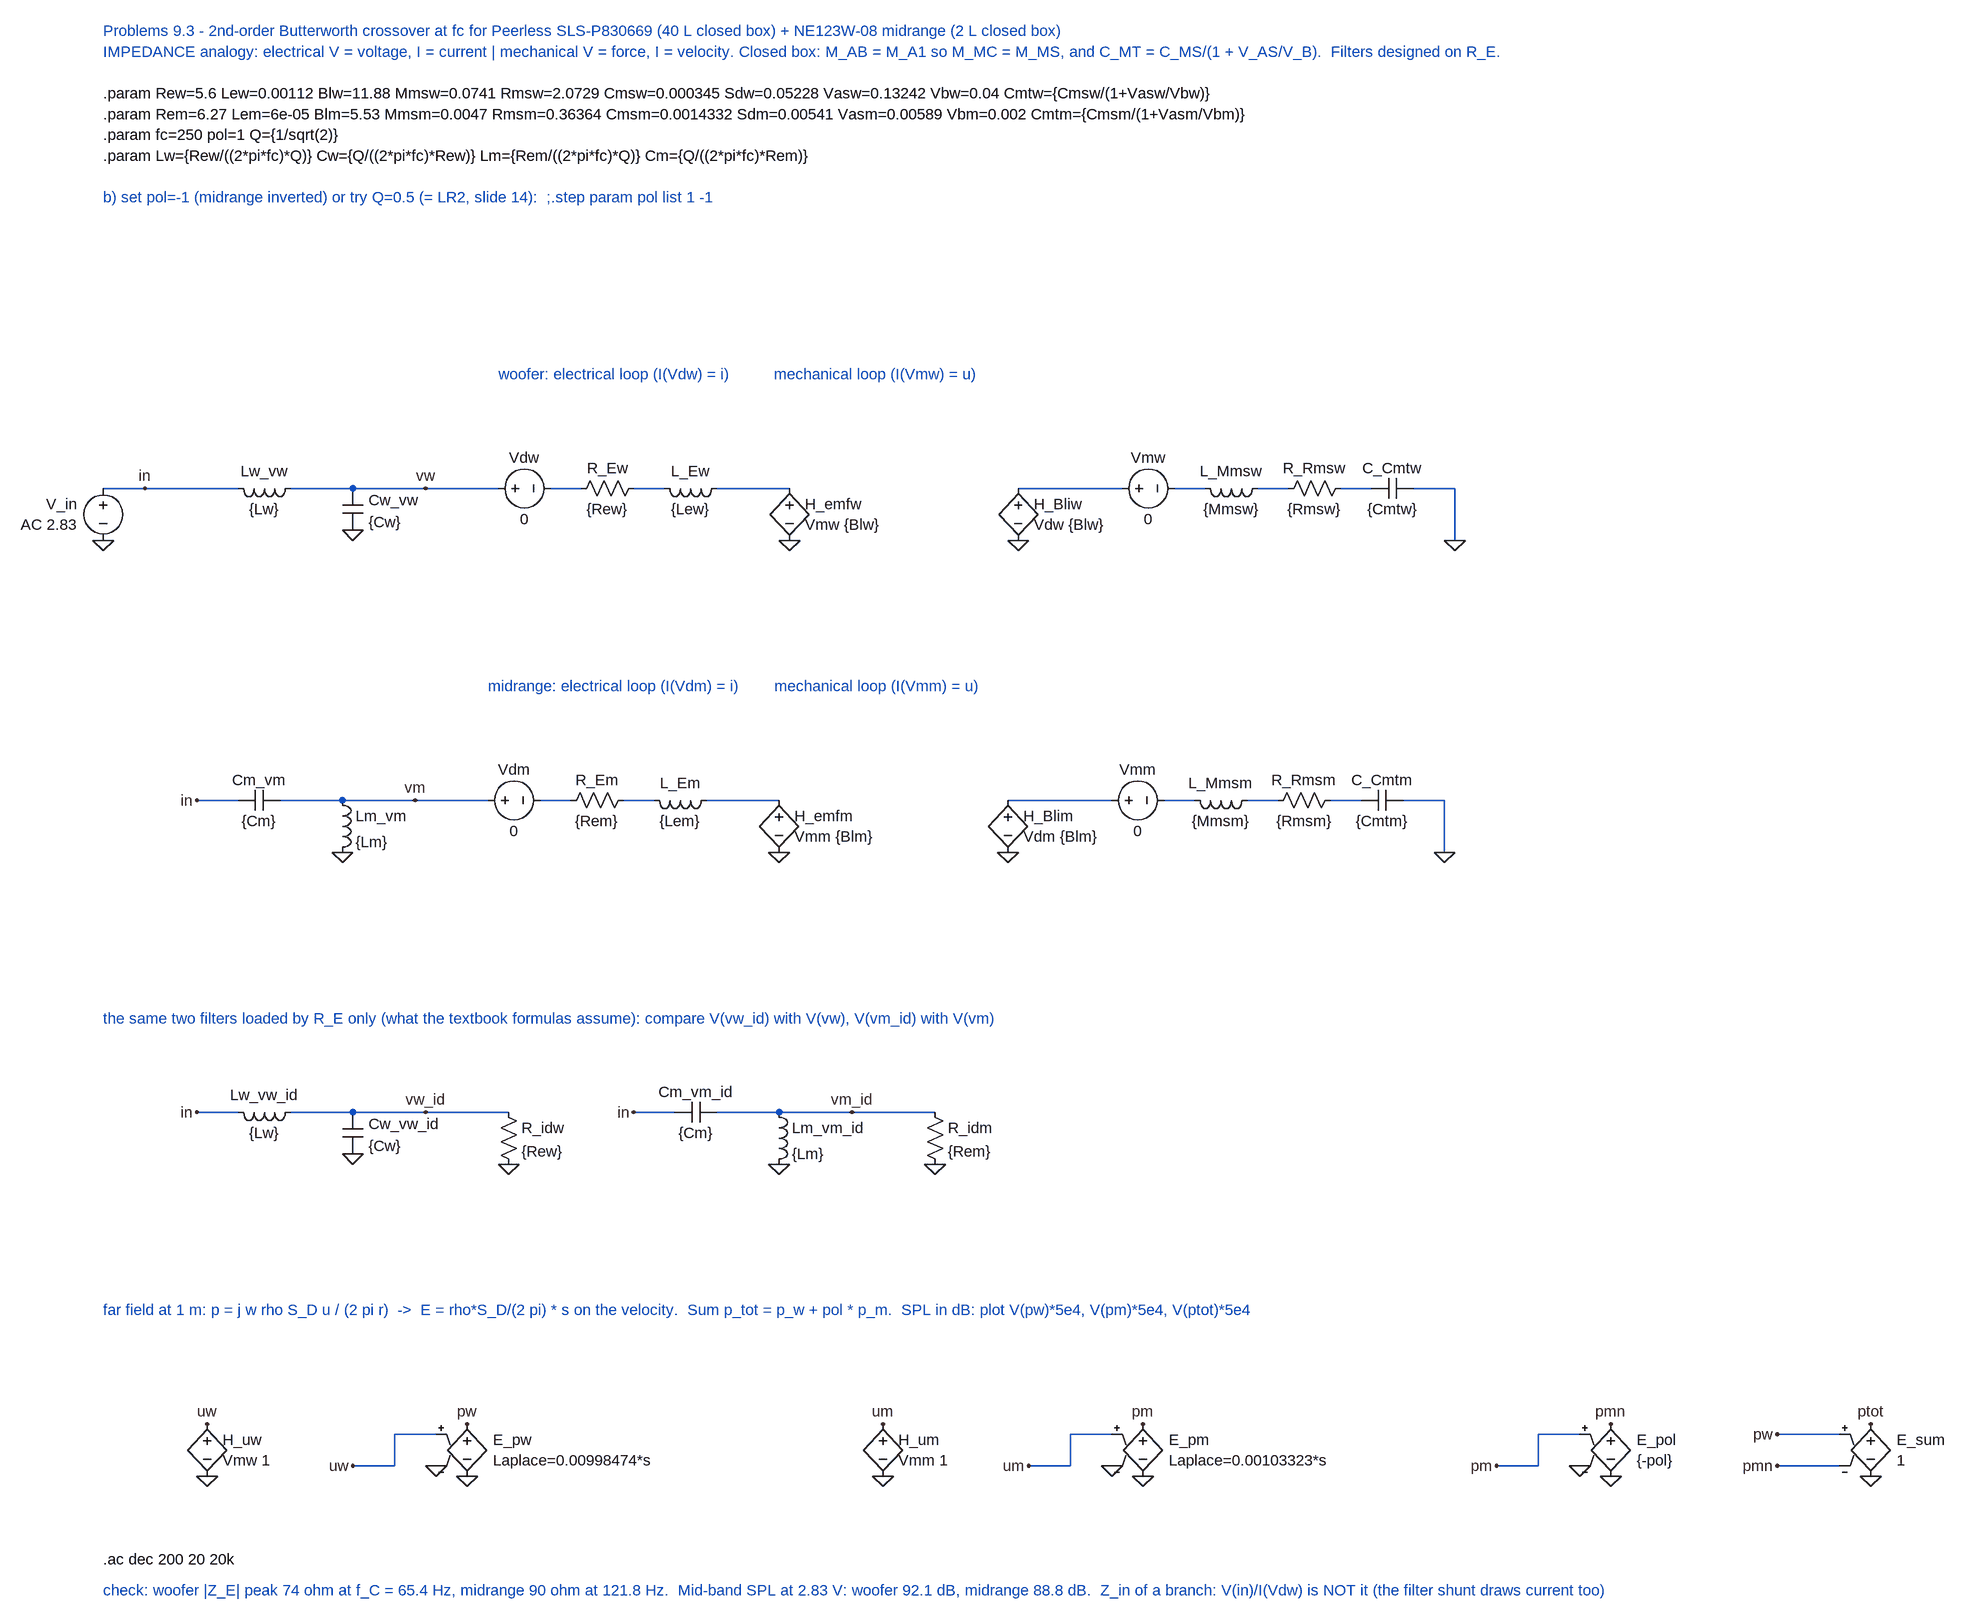
[diagram p0: schematic P9_3_BW2_250Hz.asc]
P9_3_BW2_250Hz.asc, the LTspice schematic file:
Version 4
SHEET 1 3000 1600
WIRE 0 0 144 0
WIRE 144 0 208 0
WIRE 288 0 384 0
WIRE 384 0 560 0
WIRE 688 0 736 0
WIRE 816 0 864 0
WIRE 944 0 1056 0
WIRE 1408 0 1568 0
WIRE 1648 0 1696 0
WIRE 1776 0 1824 0
WIRE 1904 0 1952 0
WIRE 2016 0 2080 0
WIRE 2080 0 2080 80
WIRE 560 0 608 0
WIRE 144 480 208 480
WIRE 272 480 368 480
WIRE 368 480 544 480
WIRE 672 480 720 480
WIRE 800 480 848 480
WIRE 928 480 1040 480
WIRE 1392 480 1552 480
WIRE 1632 480 1680 480
WIRE 1760 480 1808 480
WIRE 1888 480 1936 480
WIRE 2000 480 2064 480
WIRE 2064 480 2064 560
WIRE 544 480 592 480
WIRE 144 960 208 960
WIRE 288 960 384 960
WIRE 384 960 560 960
WIRE 560 960 624 960
WIRE 816 960 880 960
WIRE 944 960 1040 960
WIRE 1040 960 1216 960
WIRE 1216 960 1280 960
WIRE 512 1456 448 1456
WIRE 448 1456 448 1504
WIRE 448 1504 384 1504
WIRE 1552 1456 1488 1456
WIRE 1488 1456 1488 1504
WIRE 1488 1504 1424 1504
WIRE 2272 1456 2208 1456
WIRE 2208 1456 2208 1504
WIRE 2208 1504 2144 1504
WIRE 2672 1456 2576 1456
WIRE 2672 1504 2576 1504
FLAG 0 80 0
FLAG 64 0 in
FLAG 384 64 0
FLAG 496 0 vw
FLAG 1056 80 0
FLAG 1408 80 0
FLAG 2080 80 0
FLAG 144 480 in
FLAG 368 560 0
FLAG 480 480 vm
FLAG 1040 560 0
FLAG 1392 560 0
FLAG 2064 560 0
FLAG 144 960 in
FLAG 384 1024 0
FLAG 496 960 vw_id
FLAG 624 1040 0
FLAG 816 960 in
FLAG 1040 1040 0
FLAG 1152 960 vm_id
FLAG 1280 1040 0
FLAG 160 1520 0
FLAG 160 1440 uw
FLAG 560 1520 0
FLAG 512 1504 0
FLAG 384 1504 uw
FLAG 560 1440 pw
FLAG 1200 1520 0
FLAG 1200 1440 um
FLAG 1600 1520 0
FLAG 1552 1504 0
FLAG 1424 1504 um
FLAG 1600 1440 pm
FLAG 2320 1520 0
FLAG 2272 1504 0
FLAG 2144 1504 pm
FLAG 2320 1440 pmn
FLAG 2720 1520 0
FLAG 2720 1440 ptot
FLAG 2576 1456 pw
FLAG 2576 1504 pmn
SYMBOL voltage 0 -16 R0
WINDOW 0 -40 40 Right 2
WINDOW 3 -40 72 Right 2
SYMATTR InstName V_in
SYMATTR Value AC 2.83
SYMBOL ind 304 -16 R90
WINDOW 0 5 56 VBottom 2
WINDOW 3 32 56 VTop 2
SYMATTR InstName Lw_vw
SYMATTR Value {Lw}
SYMATTR SpiceLine Rser=0
SYMBOL cap 368 0 R0
WINDOW 0 40 18 Left 2
WINDOW 3 40 52 Left 2
SYMATTR InstName Cw_vw
SYMATTR Value {Cw}
SYMBOL voltage 592 0 R270
WINDOW 0 32 56 VTop 2
WINDOW 3 -32 56 VBottom 2
SYMATTR InstName Vdw
SYMATTR Value 0
SYMBOL res 832 -16 R90
WINDOW 0 0 56 VBottom 2
WINDOW 3 32 56 VTop 2
SYMATTR InstName R_Ew
SYMATTR Value {Rew}
SYMBOL ind 960 -16 R90
WINDOW 0 5 56 VBottom 2
WINDOW 3 32 56 VTop 2
SYMATTR InstName L_Ew
SYMATTR Value {Lew}
SYMATTR SpiceLine Rser=0
SYMBOL h 1056 -16 R0
WINDOW 0 24 40 Left 2
WINDOW 3 24 72 Left 2
SYMATTR InstName H_emfw
SYMATTR Value Vmw {Blw}
SYMBOL h 1408 -16 R0
WINDOW 0 24 40 Left 2
WINDOW 3 24 72 Left 2
SYMATTR InstName H_Bliw
SYMATTR Value Vdw {Blw}
SYMBOL voltage 1552 0 R270
WINDOW 0 32 56 VTop 2
WINDOW 3 -32 56 VBottom 2
SYMATTR InstName Vmw
SYMATTR Value 0
SYMBOL ind 1792 -16 R90
WINDOW 0 5 56 VBottom 2
WINDOW 3 32 56 VTop 2
SYMATTR InstName L_Mmsw
SYMATTR Value {Mmsw}
SYMATTR SpiceLine Rser=0
SYMBOL res 1920 -16 R90
WINDOW 0 0 56 VBottom 2
WINDOW 3 32 56 VTop 2
SYMATTR InstName R_Rmsw
SYMATTR Value {Rmsw}
SYMBOL cap 2016 -16 R90
WINDOW 0 0 32 VBottom 2
WINDOW 3 32 32 VTop 2
SYMATTR InstName C_Cmtw
SYMATTR Value {Cmtw}
SYMBOL cap 272 464 R90
WINDOW 0 0 32 VBottom 2
WINDOW 3 32 32 VTop 2
SYMATTR InstName Cm_vm
SYMATTR Value {Cm}
SYMBOL ind 352 464 R0
SYMATTR InstName Lm_vm
SYMATTR Value {Lm}
SYMATTR SpiceLine Rser=0
SYMBOL voltage 576 480 R270
WINDOW 0 32 56 VTop 2
WINDOW 3 -32 56 VBottom 2
SYMATTR InstName Vdm
SYMATTR Value 0
SYMBOL res 816 464 R90
WINDOW 0 0 56 VBottom 2
WINDOW 3 32 56 VTop 2
SYMATTR InstName R_Em
SYMATTR Value {Rem}
SYMBOL ind 944 464 R90
WINDOW 0 5 56 VBottom 2
WINDOW 3 32 56 VTop 2
SYMATTR InstName L_Em
SYMATTR Value {Lem}
SYMATTR SpiceLine Rser=0
SYMBOL h 1040 464 R0
WINDOW 0 24 40 Left 2
WINDOW 3 24 72 Left 2
SYMATTR InstName H_emfm
SYMATTR Value Vmm {Blm}
SYMBOL h 1392 464 R0
WINDOW 0 24 40 Left 2
WINDOW 3 24 72 Left 2
SYMATTR InstName H_Blim
SYMATTR Value Vdm {Blm}
SYMBOL voltage 1536 480 R270
WINDOW 0 32 56 VTop 2
WINDOW 3 -32 56 VBottom 2
SYMATTR InstName Vmm
SYMATTR Value 0
SYMBOL ind 1776 464 R90
WINDOW 0 5 56 VBottom 2
WINDOW 3 32 56 VTop 2
SYMATTR InstName L_Mmsm
SYMATTR Value {Mmsm}
SYMATTR SpiceLine Rser=0
SYMBOL res 1904 464 R90
WINDOW 0 0 56 VBottom 2
WINDOW 3 32 56 VTop 2
SYMATTR InstName R_Rmsm
SYMATTR Value {Rmsm}
SYMBOL cap 2000 464 R90
WINDOW 0 0 32 VBottom 2
WINDOW 3 32 32 VTop 2
SYMATTR InstName C_Cmtm
SYMATTR Value {Cmtm}
SYMBOL ind 304 944 R90
WINDOW 0 5 56 VBottom 2
WINDOW 3 32 56 VTop 2
SYMATTR InstName Lw_vw_id
SYMATTR Value {Lw}
SYMATTR SpiceLine Rser=0
SYMBOL cap 368 960 R0
WINDOW 0 40 18 Left 2
WINDOW 3 40 52 Left 2
SYMATTR InstName Cw_vw_id
SYMATTR Value {Cw}
SYMBOL res 608 944 R0
SYMATTR InstName R_idw
SYMATTR Value {Rew}
SYMBOL cap 944 944 R90
WINDOW 0 0 32 VBottom 2
WINDOW 3 32 32 VTop 2
SYMATTR InstName Cm_vm_id
SYMATTR Value {Cm}
SYMBOL ind 1024 944 R0
SYMATTR InstName Lm_vm_id
SYMATTR Value {Lm}
SYMATTR SpiceLine Rser=0
SYMBOL res 1264 944 R0
SYMATTR InstName R_idm
SYMATTR Value {Rem}
SYMBOL h 160 1424 R0
WINDOW 0 24 40 Left 2
WINDOW 3 24 72 Left 2
SYMATTR InstName H_uw
SYMATTR Value Vmw 1
SYMBOL e 560 1424 R0
WINDOW 0 40 40 Left 2
WINDOW 3 40 72 Left 2
SYMATTR InstName E_pw
SYMATTR Value Laplace=0.00998474*s
SYMBOL h 1200 1424 R0
WINDOW 0 24 40 Left 2
WINDOW 3 24 72 Left 2
SYMATTR InstName H_um
SYMATTR Value Vmm 1
SYMBOL e 1600 1424 R0
WINDOW 0 40 40 Left 2
WINDOW 3 40 72 Left 2
SYMATTR InstName E_pm
SYMATTR Value Laplace=0.00103323*s
SYMBOL e 2320 1424 R0
WINDOW 0 40 40 Left 2
WINDOW 3 40 72 Left 2
SYMATTR InstName E_pol
SYMATTR Value {-pol}
SYMBOL e 2720 1424 R0
WINDOW 0 40 40 Left 2
WINDOW 3 40 72 Left 2
SYMATTR InstName E_sum
SYMATTR Value 1
TEXT 0 -704 Left 2 ;Problems 9.3 - 2nd-order Butterworth crossover at fc for Peerless SLS-P830669 (40 L closed box) + NE123W-08 midrange (2 L closed box)
TEXT 0 -672 Left 2 ;IMPEDANCE analogy: electrical V = voltage, I = current | mechanical V = force, I = velocity. Closed box: M_AB = M_A1 so M_MC = M_MS, and C_MT = C_MS/(1 + V_AS/V_B).  Filters designed on R_E.
TEXT 0 -608 Left 2 !.param Rew=5.6 Lew=0.00112 Blw=11.88 Mmsw=0.0741 Rmsw=2.0729 Cmsw=0.000345 Sdw=0.05228 Vasw=0.13242 Vbw=0.04 Cmtw={Cmsw/(1+Vasw/Vbw)}
TEXT 0 -576 Left 2 !.param Rem=6.27 Lem=6e-05 Blm=5.53 Mmsm=0.0047 Rmsm=0.36364 Cmsm=0.0014332 Sdm=0.00541 Vasm=0.00589 Vbm=0.002 Cmtm={Cmsm/(1+Vasm/Vbm)}
TEXT 0 -544 Left 2 !.param fc=250 pol=1 Q={1/sqrt(2)}
TEXT 0 -512 Left 2 !.param Lw={Rew/((2*pi*fc)*Q)} Cw={Q/((2*pi*fc)*Rew)} Lm={Rem/((2*pi*fc)*Q)} Cm={Q/((2*pi*fc)*Rem)}
TEXT 0 -448 Left 2 ;b) set pol=-1 (midrange inverted) or try Q=0.5 (= LR2, slide 14):  ;.step param pol list 1 -1
TEXT 608 -176 Left 2 ;woofer: electrical loop (I(Vdw) = i)          mechanical loop (I(Vmw) = u)
TEXT 592 304 Left 2 ;midrange: electrical loop (I(Vdm) = i)        mechanical loop (I(Vmm) = u)
TEXT 0 816 Left 2 ;the same two filters loaded by R_E only (what the textbook formulas assume): compare V(vw_id) with V(vw), V(vm_id) with V(vm)
TEXT 0 1264 Left 2 ;far field at 1 m: p = j w rho S_D u / (2 pi r)  ->  E = rho*S_D/(2 pi) * s on the velocity.  Sum p_tot = p_w + pol * p_m.  SPL in dB: plot V(pw)*5e4, V(pm)*5e4, V(ptot)*5e4
TEXT 0 1648 Left 2 !.ac dec 200 20 20k
TEXT 0 1696 Left 2 ;check: woofer |Z_E| peak 74 ohm at f_C = 65.4 Hz, midrange 90 ohm at 121.8 Hz.  Mid-band SPL at 2.83 V: woofer 92.1 dB, midrange 88.8 dB.  Z_in of a branch: V(in)/I(Vdw) is NOT it (the filter shunt draws current too)

The netlist it stands for:
* P9_3_BW2_250Hz.asc
V_in in 0 AC 2.83
Lw_vw vw in {Lw} Rser=0
Cw_vw vw 0 {Cw}
Vdw vw N001 0
R_Ew N002 N001 {Rew}
L_Ew N003 N002 {Lew} Rser=0
H_emfw N003 0 Vmw {Blw}
H_Bliw N004 0 Vdw {Blw}
Vmw N004 N005 0
L_Mmsw N006 N005 {Mmsw} Rser=0
R_Rmsw N007 N006 {Rmsw}
C_Cmtw 0 N007 {Cmtw}
Cm_vm vm in {Cm}
Lm_vm vm 0 {Lm} Rser=0
Vdm vm N008 0
R_Em N009 N008 {Rem}
L_Em N010 N009 {Lem} Rser=0
H_emfm N010 0 Vmm {Blm}
H_Blim N011 0 Vdm {Blm}
Vmm N011 N012 0
L_Mmsm N013 N012 {Mmsm} Rser=0
R_Rmsm N014 N013 {Rmsm}
C_Cmtm 0 N014 {Cmtm}
Lw_vw_id vw_id in {Lw} Rser=0
Cw_vw_id vw_id 0 {Cw}
R_idw vw_id 0 {Rew}
Cm_vm_id vm_id in {Cm}
Lm_vm_id vm_id 0 {Lm} Rser=0
R_idm vm_id 0 {Rem}
H_uw uw 0 Vmw 1
E_pw pw 0 uw 0 Laplace=0.00998474*s
H_um um 0 Vmm 1
E_pm pm 0 um 0 Laplace=0.00103323*s
E_pol pmn 0 pm 0 {-pol}
E_sum ptot 0 pw pmn 1
* Problems 9.3 - 2nd-order Butterworth crossover at fc for Peerless SLS-P830669 (40 L closed box) + NE123W-08 midrange (2 L closed box)
* IMPEDANCE analogy: electrical V = voltage, I = current | mechanical V = force, I = velocity. Closed box: M_AB = M_A1 so M_MC = M_MS, and C_MT = C_MS/(1 + V_AS/V_B).  Filters designed on R_E.
.param Rew=5.6 Lew=0.00112 Blw=11.88 Mmsw=0.0741 Rmsw=2.0729 Cmsw=0.000345 Sdw=0.05228 Vasw=0.13242 Vbw=0.04 Cmtw={Cmsw/(1+Vasw/Vbw)}
.param Rem=6.27 Lem=6e-05 Blm=5.53 Mmsm=0.0047 Rmsm=0.36364 Cmsm=0.0014332 Sdm=0.00541 Vasm=0.00589 Vbm=0.002 Cmtm={Cmsm/(1+Vasm/Vbm)}
.param fc=250 pol=1 Q={1/sqrt(2)}
.param Lw={Rew/((2*pi*fc)*Q)} Cw={Q/((2*pi*fc)*Rew)} Lm={Rem/((2*pi*fc)*Q)} Cm={Q/((2*pi*fc)*Rem)}
* b) set pol=-1 (midrange inverted) or try Q=0.5 (= LR2, slide 14):  ;.step param pol list 1 -1
* woofer: electrical loop (I(Vdw) = i)          mechanical loop (I(Vmw) = u)
* midrange: electrical loop (I(Vdm) = i)        mechanical loop (I(Vmm) = u)
* the same two filters loaded by R_E only (what the textbook formulas assume): compare V(vw_id) with V(vw), V(vm_id) with V(vm)
* far field at 1 m: p = j w rho S_D u / (2 pi r)  ->  E = rho*S_D/(2 pi) * s on the velocity.  Sum p_tot = p_w + pol * p_m.  SPL in dB: plot V(pw)*5e4, V(pm)*5e4, V(ptot)*5e4
.ac dec 200 20 20k
* check: woofer |Z_E| peak 74 ohm at f_C = 65.4 Hz, midrange 90 ohm at 121.8 Hz.  Mid-band SPL at 2.83 V: woofer 92.1 dB, midrange 88.8 dB.  Z_in of a branch: V(in)/I(Vdw) is NOT it (the filter shunt draws current too)
.backanno
.end